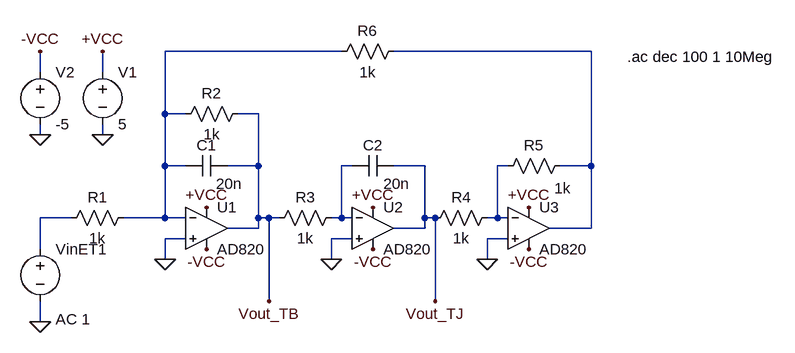
[diagram p0: schematic Etaj2Banda.asc]
Etaj2Banda.asc, the LTspice schematic file:
Version 4.1
SHEET 1 1036 680
WIRE 320 -32 48 -32
WIRE 704 -32 400 -32
WIRE -144 0 -144 -32
WIRE -48 0 -48 -32
WIRE 48 64 48 -32
WIRE 80 64 48 64
WIRE 192 64 160 64
WIRE -144 96 -144 80
WIRE -48 96 -48 80
WIRE 48 144 48 64
WIRE 80 144 48 144
WIRE 192 144 192 64
WIRE 192 144 144 144
WIRE 336 144 320 144
WIRE 448 144 400 144
WIRE 576 144 560 144
WIRE 704 144 704 -32
WIRE 704 144 656 144
WIRE -96 224 -144 224
WIRE 48 224 48 144
WIRE 48 224 -16 224
WIRE 80 224 48 224
WIRE 192 224 192 144
WIRE 208 224 192 224
WIRE 224 224 208 224
WIRE 320 224 320 144
WIRE 320 224 304 224
WIRE 336 224 320 224
WIRE 448 224 448 144
WIRE 464 224 448 224
WIRE 560 224 560 144
WIRE 560 224 544 224
WIRE 576 224 560 224
WIRE 192 240 192 224
WIRE 192 240 144 240
WIRE 448 240 448 224
WIRE 448 240 400 240
WIRE 704 240 704 144
WIRE 704 240 640 240
WIRE 80 256 48 256
WIRE 336 256 304 256
WIRE 576 256 544 256
WIRE -144 272 -144 224
WIRE 48 288 48 256
WIRE 304 288 304 256
WIRE 544 288 544 256
WIRE 208 352 208 224
WIRE 464 352 464 224
WIRE -144 384 -144 352
FLAG 48 288 0
FLAG 304 288 0
FLAG 544 288 0
FLAG -144 96 0
FLAG -48 96 0
FLAG -48 -32 +VCC
FLAG 112 208 +VCC
FLAG 368 208 +VCC
FLAG 608 208 +VCC
FLAG -144 -32 -VCC
FLAG 112 272 -VCC
FLAG 368 272 -VCC
FLAG 608 272 -VCC
FLAG -144 384 0
FLAG 208 352 Vout_TB
FLAG 464 352 Vout_TJ
SYMBOL res 0 208 R90
WINDOW 0 0 56 VBottom 2
WINDOW 3 32 56 VTop 2
SYMATTR InstName R1
SYMATTR Value 1k
SYMBOL cap 144 128 R90
WINDOW 0 0 32 VBottom 2
WINDOW 3 28 -3 VTop 2
SYMATTR InstName C1
SYMATTR Value 20n
SYMBOL res 176 48 R90
WINDOW 0 0 56 VBottom 2
WINDOW 3 32 56 VTop 2
SYMATTR InstName R2
SYMATTR Value 1k
SYMBOL res 320 208 R90
WINDOW 0 0 56 VBottom 2
WINDOW 3 32 56 VTop 2
SYMATTR InstName R3
SYMATTR Value 1k
SYMBOL cap 400 128 R90
WINDOW 0 0 32 VBottom 2
WINDOW 3 28 -5 VTop 2
SYMATTR InstName C2
SYMATTR Value 20n
SYMBOL res 560 208 R90
WINDOW 0 0 56 VBottom 2
WINDOW 3 32 56 VTop 2
SYMATTR InstName R4
SYMATTR Value 1k
SYMBOL res 672 128 R90
WINDOW 0 0 56 VBottom 2
WINDOW 3 35 12 VTop 2
SYMATTR InstName R5
SYMATTR Value 1k
SYMBOL res 416 -48 R90
WINDOW 0 0 56 VBottom 2
WINDOW 3 32 56 VTop 2
SYMATTR InstName R6
SYMATTR Value 1k
SYMBOL voltage -48 -16 R0
SYMATTR InstName V1
SYMATTR Value 5
SYMBOL voltage -144 -16 R0
SYMATTR InstName V2
SYMATTR Value -5
SYMBOL voltage -144 256 R0
WINDOW 123 24 124 Left 2
WINDOW 39 0 0 Left 0
SYMATTR Value2 AC 1
SYMATTR InstName VinET1
SYMATTR Value ""
SYMBOL OpAmps\\AD820 112 176 R0
SYMATTR InstName U1
SYMBOL OpAmps\\AD820 368 176 R0
SYMATTR InstName U2
SYMBOL OpAmps\\AD820 608 176 R0
SYMATTR InstName U3
TEXT 760 -24 Left 2 !.ac dec 100 1 10Meg

The netlist it stands for:
* Etaj2Banda.asc
R1 N001 N005 1k
C1 Vout_TB N001 20n
R2 Vout_TB N001 1k
R3 N003 Vout_TB 1k
C2 Vout_TJ N003 20n
R4 N004 Vout_TJ 1k
R5 N002 N004 1k
R6 N002 N001 1k
V1 +VCC 0 5
V2 -VCC 0 -5
VinET1 N005 0 AC 1
X§U1 0 N001 +VCC -VCC Vout_TB AD820  ; pins In+ In- V+ V- OUT
X§U2 0 N003 +VCC -VCC Vout_TJ AD820  ; pins In+ In- V+ V- OUT
X§U3 0 N004 +VCC -VCC N002 AD820  ; pins In+ In- V+ V- OUT
.ac dec 100 1 10Meg
.backanno
.end